# Altium schematic sheet Nescessary documentations.SchDoc
size A4; SheetNumber: 2; SheetTotal: 3
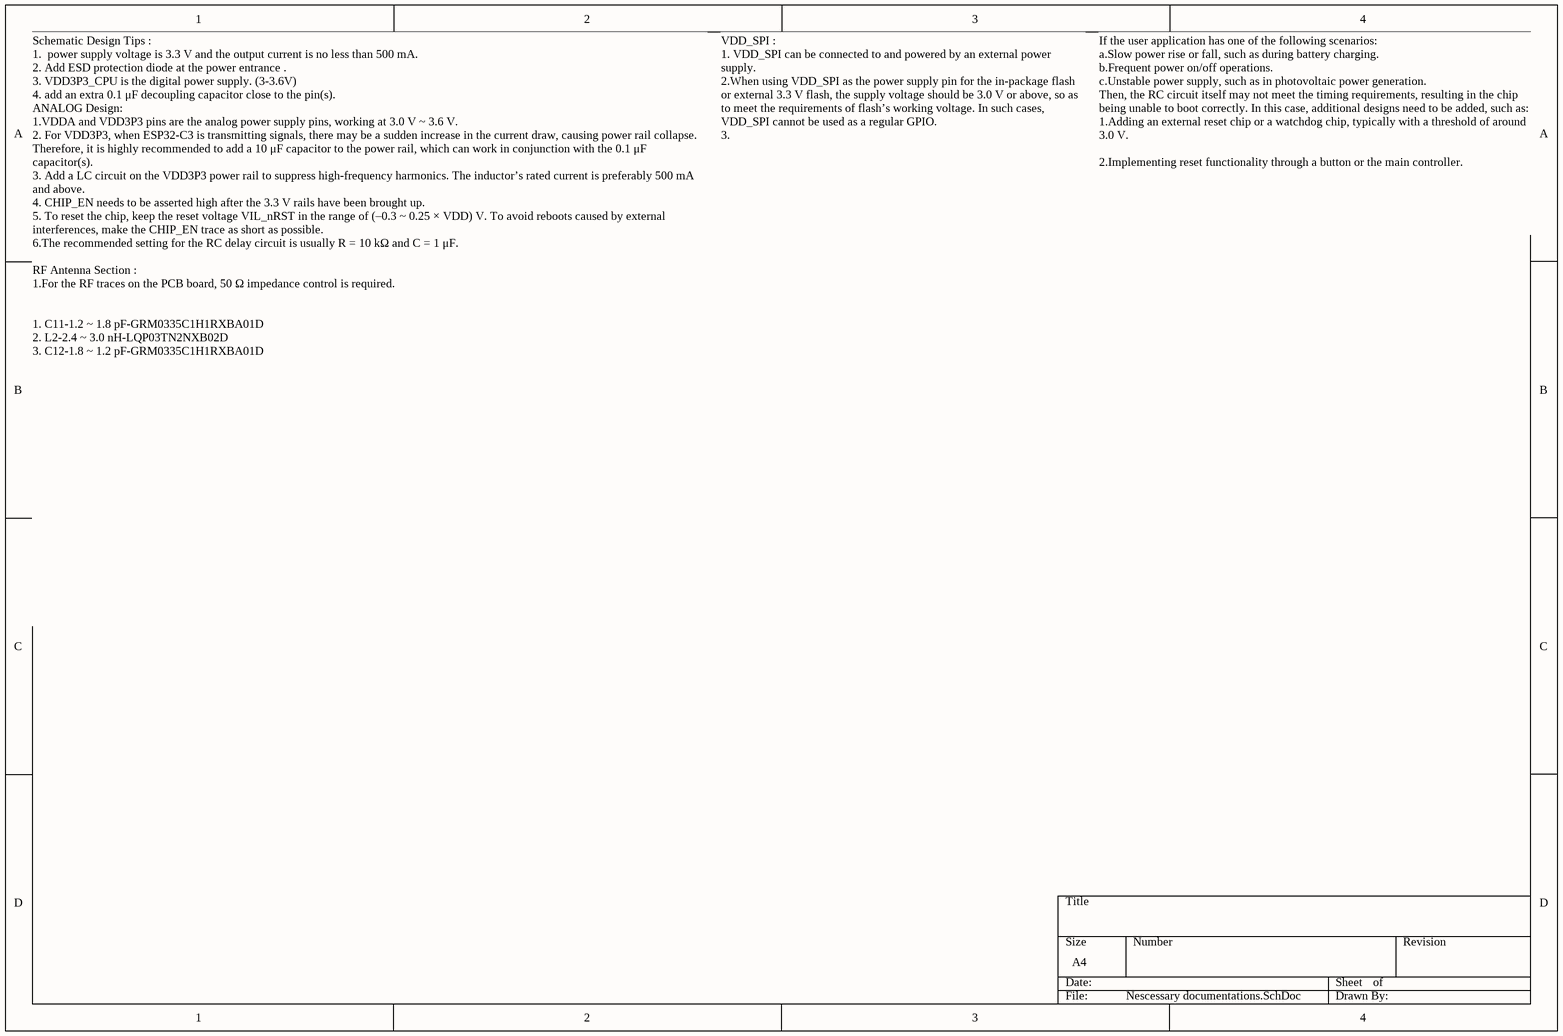
[diagram p0: Nescessary documentations.SchDoc]

## Notes on the sheet
- VDD_SPI :
  1. VDD_SPI can be connected to and powered by an external power supply.
  2.When using VDD_SPI as the power supply pin for the in-package flash or external 3.3 V flash, the supply voltage should be 3.0 V or above, so as to meet the requirements of flash’s working voltage. In such cases, VDD_SPI cannot be used as a regular GPIO.
  3.
- If the user application has one of the following scenarios:
  a.Slow power rise or fall, such as during battery charging.
  b.Frequent power on/off operations.
  c.Unstable power supply, such as in photovoltaic power generation.
  Then, the RC circuit itself may not meet the timing requirements, resulting in the chip being unable to boot correctly. In this case, additional designs need to be added, such as:
  1.Adding an external reset chip or a watchdog chip, typically with a threshold of around 3.0 V.
  2.Implementing reset functionality through a button or the main controller.
- Schematic Design Tips :
  1.  power supply voltage is 3.3 V and the output current is no less than 500 mA.
  2. Add ESD protection diode at the power entrance .
  3. VDD3P3_CPU is the digital power supply. (3-3.6V)
  4. add an extra 0.1 μF decoupling capacitor close to the pin(s).
  ANALOG Design:
  1.VDDA and VDD3P3 pins are the analog power supply pins, working at 3.0 V ~ 3.6 V.
  2. For VDD3P3, when ESP32-C3 is transmitting signals, there may be a sudden increase in the current draw, causing power rail collapse. Therefore, it is highly recommended to add a 10 μF capacitor to the power rail, which can work in conjunction with the 0.1 μF capacitor(s).
  3. Add a LC circuit on the VDD3P3 power rail to suppress high-frequency harmonics. The inductor’s rated current is preferably 500 mA and above.
  4. CHIP_EN needs to be asserted high after the 3.3 V rails have been brought up.
  5. To reset the chip, keep the reset voltage VIL_nRST in the range of (–0.3 ~ 0.25 × VDD) V. To avoid reboots caused by external interferences, make the CHIP_EN trace as short as possible.
  6.The recommended setting for the RC delay circuit is usually R = 10 kΩ and C = 1 μF.
  RF Antenna Section :
  1.For the RF traces on the PCB board, 50 Ω impedance control is required.
  1. C11-1.2 ~ 1.8 pF-GRM0335C1H1RXBA01D
  2. L2-2.4 ~ 3.0 nH-LQP03TN2NXB02D
  3. C12-1.8 ~ 1.2 pF-GRM0335C1H1RXBA01D